# Altium schematic sheet SYNC-VideoSum.SchDoc: SYNC/Video Sum
size A4
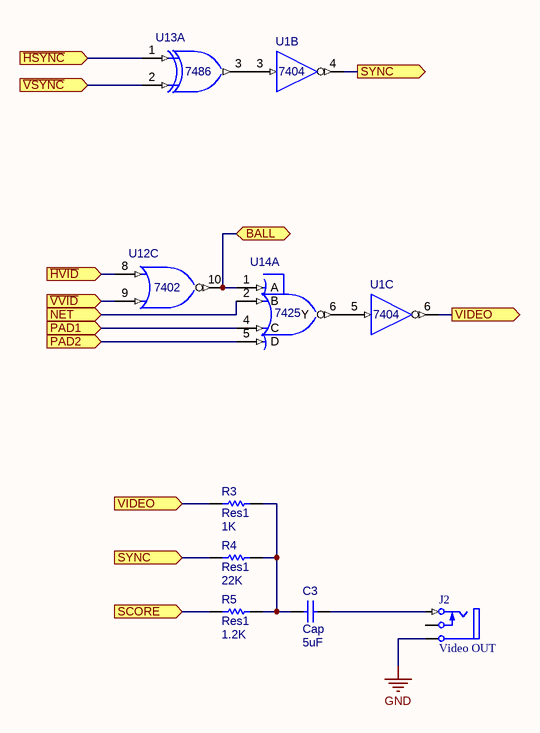
[diagram p0: SYNC-VideoSum.SchDoc]

## Parts
C3  Cap  value 5uF  [CAPR10.16-11.5x3.6]
J2  Video OUT  [RCA 2]
R3  Res1  value 1K  [AXIAL-0.4]
R4  Res1  value 22K  [AXIAL-0.4]
R5  Res1  value 1.2K  [AXIAL-0.4]
U1  7404  [N014]  (parts B,C of 6)
U12  7402  [N014]  (part C of 4)
U13  7486  [N014]  (part A of 4)
U14  7425  [N014]  (part A of 2)

## Ports
BALL, NET, PAD1, PAD2, SCORE, SYNC, VIDEO, ~{HSYNC}, ~{HVID}, ~{VSYNC}, ~{VVID}

## Nets
GND: J2.1(S) U1.7(GND) U12.7(GND) U13.7(GND) U14.7(GND)
VCC: U1.14(VCC) U12.14(VCC) U13.14(VCC) U14.3(G) U14.14(VCC)
~{HSYNC}: U13.1(A) ; port ~{HSYNC}
~{HVID}: U12.8(A) ; port ~{HVID}
~{VSYNC}: U13.2(B) ; port ~{VSYNC}
~{VVID}: U12.9(B) ; port ~{VVID}
BALL: U12.10(Y) U14.1(A) ; port BALL
NET: U14.2(B) ; port NET
PAD1: U14.4(C) ; port PAD1
PAD2: U14.5(D) ; port PAD2
SCORE: R5.1 ; port SCORE
SYNC: R4.1 U1.4(Y) ; port SYNC
VIDEO: R3.1 U1.6(Y) ; port VIDEO
NetC3_1: C3.1 R3.2 R4.2 R5.2
NetC3_2: C3.2 J2.2(T)
NetU1_3: U1.3(A) U13.3(Y)
NetU1_5: U1.5(A) U14.6(Y)

Not connected (* = marked no-connect by the designer): J2 3(TN)

## Notes on the sheet
- Text
- Page
- PONG

## Library data of the parts
C3 = Cap: Capacitor; Published: 8-Jun-2000; LatestRevisionDate: 17-Jul-2002; LatestRevisionNote: Re-released for DXP Platform.; PackageReference: RAD-0.3; Publisher: Altium Limited; PackageDescription: Radial Cap, Thru-Hole; 2 Leads; 0.3 in Pin Spacing
J2 = Phonejack2 TN: Jack Socket, 1/4" [6.5mm], Thru-Hole, Vertical, 2-Conductor with Tip closed; PackageDocument: 2003; PCB_Layout: Complies with manufacturer's recommendation.; DrillAndSlotSize: Corresponds to nominal value.; LatestRevisionDate: 15-Jul-2004; LatestRevisionNote: Component Replaced & renamed from "Phonejack".; DatasheetDocument: 2003; PackageReference: S1VS_SNB; Publisher: Altium Limited; ComponentLink1Description: Manufacturer Link; ComponentLink1URL: http://www.cliffuk.co.uk/
R3-R5 = Res1: Resistor; Published: 8-Jun-2000; LatestRevisionDate: 17-Jul-2002; LatestRevisionNote: Re-released for DXP Platform.; PackageReference: AXIAL-0.3; Publisher: Altium Limited; PackageDescription: Axial Device, Thru-Hole; 2 Leads; 0.3 in Pin Spacing
U1 = SN74LS04N: Hex Inverter; Published: 8-Jun-2000; LatestRevisionDate: 04-Mar-2005; LatestRevisionNote: Stylized 3D Model Added.; DatasheetVersion: Mar-1988; PackageVersion: Oct-1995; PackageReference: N014; Publisher: Altium Limited; PackageDescription: DIP; 14 Leads; Row Spacing 7.62 mm; Pitch 2.54 mm; ComponentLink1Description: Manufacturer Link; ComponentLink1URL: http://www.ti.com/; ComponentLink2Description: Datasheet; ComponentLink2URL: http://www-s.ti.com/sc/ds/sn74ls04.pdf
U12 = SN74LS02N: Quadruple 2-Input Positive-NOR Gate; Published: 8-Jun-2000; LatestRevisionDate: 04-Mar-2005; LatestRevisionNote: Stylized 3D Model Added.; DatasheetVersion: Mar-1988; PackageVersion: Oct-1995; PackageReference: N014; Publisher: Altium Limited; PackageDescription: DIP; 14 Leads; Row Spacing 7.62 mm; Pitch 2.54 mm; ComponentLink1Description: Manufacturer Link; ComponentLink1URL: http://www.ti.com/; ComponentLink2Description: Datasheet; ComponentLink2URL: http://www-s.ti.com/sc/ds/sn54s02.pdf
U13 = SN74LS86AN: Quadruple 2-Input Exclusive-OR Gate; Published: 8-Jun-2000; LatestRevisionDate: 04-Mar-2005; LatestRevisionNote: Stylized 3D Model Added.; DatasheetVersion: Mar-1988; PackageVersion: Oct-1995; PackageReference: N014; Publisher: Altium Limited; PackageDescription: DIP; 14 Leads; Row Spacing 7.62 mm; Pitch 2.54 mm; ComponentLink1Description: Manufacturer Link; ComponentLink1URL: http://www.ti.com/; ComponentLink2Description: Datasheet; ComponentLink2URL: http://www-s.ti.com/sc/ds/sn74ls86a.pdf
U14 = SN7425N: Dual 4-Input NOR Gate with Strobe; Published: 8-Jun-2000; LatestRevisionDate: 04-Mar-2005; LatestRevisionNote: Stylized 3D Model Added.; DatasheetVersion: Mar-1988; PackageVersion: Oct-1995; PackageReference: N014; Publisher: Altium Limited; PackageDescription: DIP; 14 Leads; Row Spacing 7.62 mm; Pitch 2.54 mm; ComponentLink1Description: Manufacturer Link; ComponentLink1URL: http://www.ti.com/; ComponentLink2Description: Datasheet; ComponentLink2URL: http://www-s.ti.com/sc/ds/sn5425.pdf; ComponentLink3Description: Packaging Specification; ComponentLink3URL: http://focus.ti.com/lit/ml/mpdi002c/mpdi002c.pdf